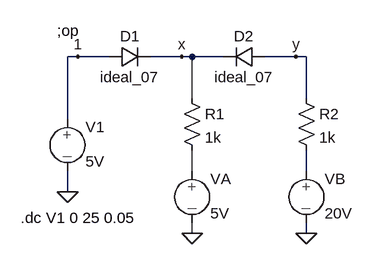
[diagram p0: schematic schalt_mit_2_dioden.asc]
schalt_mit_2_dioden.asc, the LTspice schematic file:
Version 4
SHEET 1 880 680
WIRE 96 128 80 128
WIRE 144 128 96 128
WIRE 256 128 208 128
WIRE 272 128 256 128
WIRE 320 128 272 128
WIRE 432 128 384 128
WIRE 448 128 432 128
WIRE 272 192 272 128
WIRE 448 192 448 128
WIRE 80 224 80 128
WIRE 272 304 272 272
WIRE 448 304 448 272
WIRE 80 336 80 304
WIRE 272 400 272 384
WIRE 448 400 448 384
FLAG 448 400 0
FLAG 272 400 0
FLAG 80 336 0
FLAG 256 128 x
FLAG 432 128 y
FLAG 96 128 1
SYMBOL diode 144 144 R270
WINDOW 0 32 32 VTop 2
WINDOW 3 0 32 VBottom 2
SYMATTR InstName D1
SYMATTR Value ideal_07
SYMBOL diode 384 144 M270
WINDOW 0 32 32 VTop 2
WINDOW 3 0 32 VBottom 2
SYMATTR InstName D2
SYMATTR Value ideal_07
SYMBOL res 256 176 R0
SYMATTR InstName R1
SYMATTR Value 1k
SYMBOL res 432 176 R0
SYMATTR InstName R2
SYMATTR Value 1k
SYMBOL source-V 272 288 R0
SYMATTR InstName VA
SYMATTR Value 5V
SYMBOL source-V 448 288 R0
SYMATTR InstName VB
SYMATTR Value 20V
SYMBOL source-V 80 208 R0
SYMATTR InstName V1
SYMATTR Value 5V
TEXT 64 88 Left 2 !;op
TEXT 8 376 Left 2 !.dc V1 0 25 0.05

The netlist it stands for:
* schalt_mit_2_dioden.asc
D1 1 x ideal_07
D2 y x ideal_07
R1 x N001 1k
R2 y N002 1k
VA N001 0 5V
VB N002 0 20V
V1 1 0 5V
.model D D
.lib standard.dio
;op
.dc V1 0 25 0.05
.backanno
.end